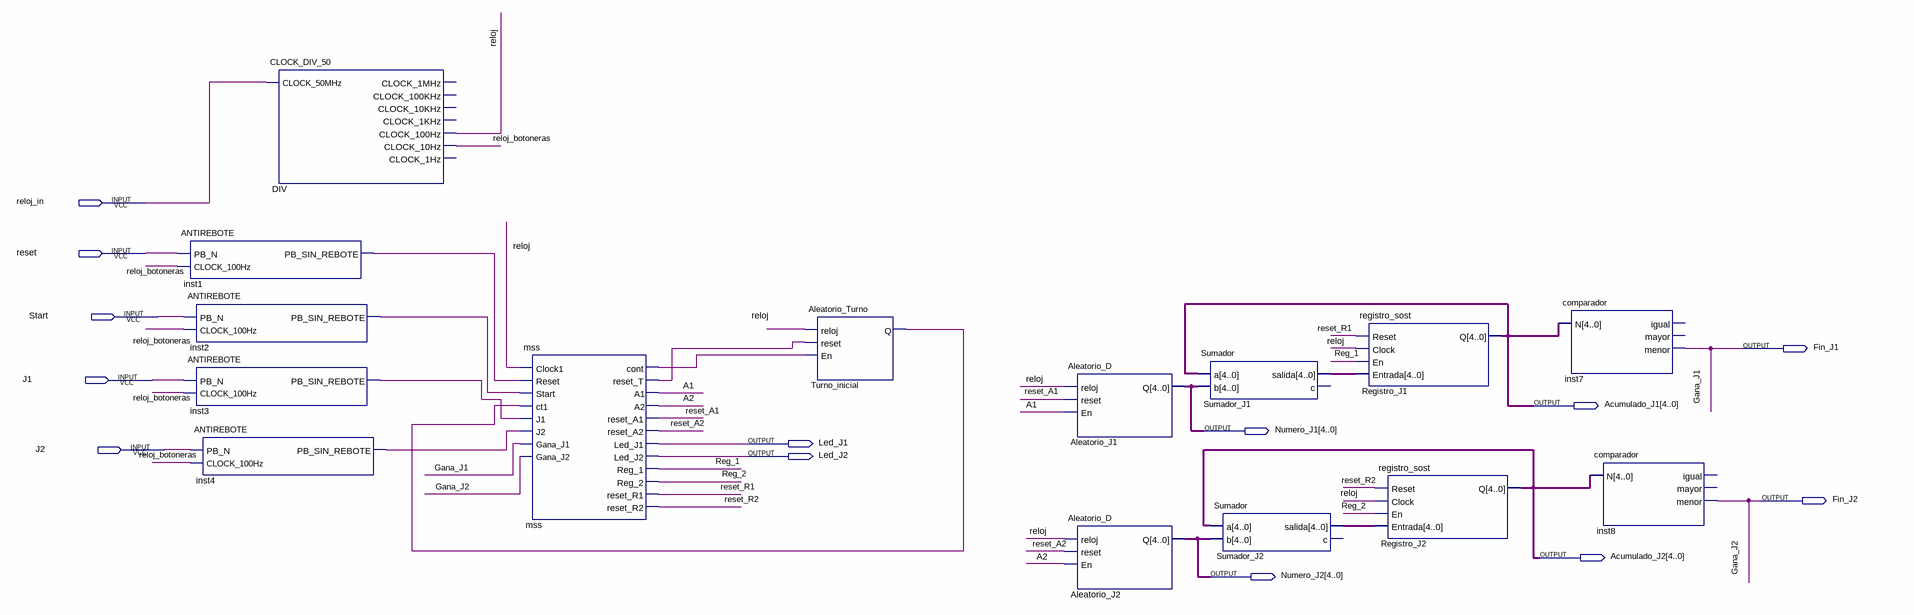
[diagram p0: schematic sheet]
// Quartus schematic Diagrama_prueba.bdf as structural Verilog: 15 symbols, 13 pins
module Diagrama_prueba (
  input  reloj_in,
  input  reset,
  input  Start,
  input  J1,
  input  J2,
  output Fin_J1,
  output [4:0] Acumulado_J1,
  output [4:0] Numero_J1,
  output Led_J1,
  output Led_J2,
  output Fin_J2,
  output [4:0] Acumulado_J2,
  output [4:0] Numero_J2
);

  wire A1, A2, inst1_pb_sin_rebote, inst2_pb_sin_rebote, inst3_pb_sin_rebote, inst4_pb_sin_rebote, mss_cont,
       mss_reset_t, Reg_1, Reg_2, reloj, reloj_botoneras, reset_A1, reset_A2, reset_R1, reset_R2,
       Turno_inicial_q;
  wire [4:0] Sumador_J1_salida, Sumador_J2_salida;

  ANTIREBOTE inst1 (.PB_N(reset), .CLOCK_100Hz(reloj_botoneras), .PB_SIN_REBOTE(inst1_pb_sin_rebote));
  ANTIREBOTE inst2 (.PB_N(Start), .CLOCK_100Hz(reloj_botoneras), .PB_SIN_REBOTE(inst2_pb_sin_rebote));
  ANTIREBOTE inst3 (.PB_N(J1), .CLOCK_100Hz(reloj_botoneras), .PB_SIN_REBOTE(inst3_pb_sin_rebote));
  ANTIREBOTE inst4 (.PB_N(J2), .CLOCK_100Hz(reloj_botoneras), .PB_SIN_REBOTE(inst4_pb_sin_rebote));
  CLOCK_DIV_50 DIV (
    .CLOCK_50MHz(reloj_in), .CLOCK_100Hz(reloj), .CLOCK_10Hz(reloj_botoneras));  // open: CLOCK_1MHz, CLOCK_100KHz, CLOCK_10KHz, CLOCK_1KHz, CLOCK_1Hz
  mss mss (
    .Clock1(reloj), .Reset(inst1_pb_sin_rebote), .Start(inst2_pb_sin_rebote), .ct1(Turno_inicial_q),
    .J1(inst3_pb_sin_rebote), .J2(inst4_pb_sin_rebote), .Gana_J1(Fin_J1), .Gana_J2(Fin_J2), .cont(mss_cont),
    .reset_T(mss_reset_t), .A1(A1), .A2(A2), .reset_A1(reset_A1), .reset_A2(reset_A2), .Led_J1(Led_J1),
    .Led_J2(Led_J2), .Reg_1(Reg_1), .Reg_2(Reg_2), .reset_R1(reset_R1), .reset_R2(reset_R2));
  Aleatorio_Turno Turno_inicial (.reloj(reloj), .reset(mss_reset_t), .En(mss_cont), .Q(Turno_inicial_q));
  Aleatorio_D Aleatorio_J1 (.reloj(reloj), .reset(reset_A1), .En(A1), .Q(Numero_J1));
  Aleatorio_D Aleatorio_J2 (.reloj(reloj), .reset(reset_A2), .En(A2), .Q(Numero_J2));
  Sumador Sumador_J1 (.a(Acumulado_J1), .b(Numero_J1), .salida(Sumador_J1_salida));  // open: c
  Sumador Sumador_J2 (.a(Acumulado_J2), .b(Numero_J2), .salida(Sumador_J2_salida));  // open: c
  registro_sost Registro_J1 (
    .Reset(reset_R1), .Clock(reloj), .En(Reg_1), .Entrada(Sumador_J1_salida), .Q(Acumulado_J1));
  registro_sost Registro_J2 (
    .Reset(reset_R2), .Clock(reloj), .En(Reg_2), .Entrada(Sumador_J2_salida), .Q(Acumulado_J2));
  comparador inst7 (.N(Acumulado_J1), .menor(Fin_J1));  // open: igual, mayor
  comparador inst8 (.N(Acumulado_J2), .menor(Fin_J2));  // open: igual, mayor

  // Other names for the same wires on the sheet: Gana_J1 = Fin_J1; Gana_J2 = Fin_J2
endmodule
